# EAGLE schematic mod_switch_battery_voltage (EAGLE 8.4.1)
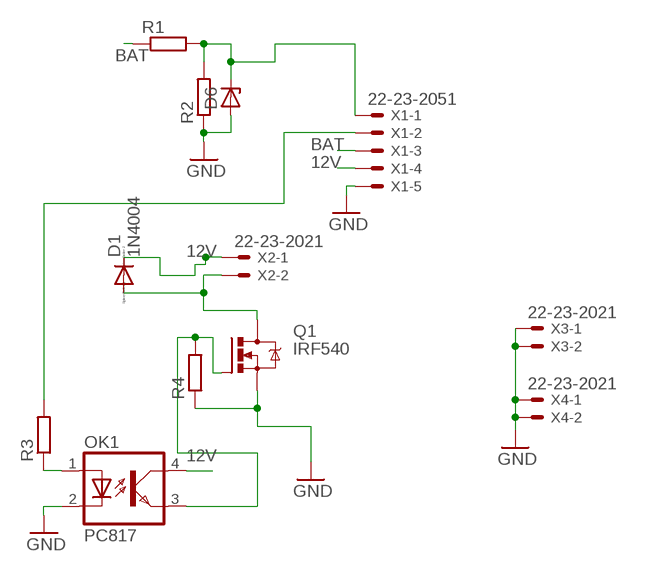
[diagram p0: schematic, sheet 1]

## Parts
D1  1N4004  [DO41-10]
D6  ZENER-DIODEDO34-7  [DO34Z7]
OK1  PC817  [DIL04]
Q1  IRF540  [TO220BV]
R1  R-EU_0204/5  [0204/5]
R2  R-EU_0204/5  [0204/5]
R3  R-EU_0204/5  [0204/5]
R4  R-EU_0204/5  [0204/5]
X1  22-23-2051  [22-23-2051]
X2  22-23-2021  [22-23-2021]
X3  22-23-2021  [22-23-2021]
X4  22-23-2021  [22-23-2021]

## Nets
12V: D1.C OK1.4(COL) X1.4 X2.1
BAT: R1.1 X1.3
GND: D6.A OK1.2(C) Q1.S R2.1 R4.1 X1.5 X3.1 X3.2 X4.1 X4.2
N$4: OK1.1(A) R3.1
N$5: D1.A Q1.D X2.2
N$6: R3.2 X1.2
N$7: OK1.3(EMIT) Q1.G R4.2
N$43: D6.C R1.2 R2.2 X1.1

## Library data of the parts
D1 = diode:1N4004: DIODE general purpose rectifier, 1 A
D6 = diode:ZENER-DIODE: Z-Diode
OK1 = optocoupler:PC817: SHARP OPTO COUPLER; MPN: PC817X4J000F; OC_FARNELL: 9707727; OC_NEWARK: 97K7059
Q1 = transistor-power:IRF540: HEXFET Power MOSFET
R1-R4 = resistor:R-EU_: RESISTOR, European symbol
X1 = con-molex:22-23-2051: .100" (2.54mm) Center Header - 5 Pin; MF: MOLEX; MPN: 22-23-2051; OC_FARNELL: 1462952; OC_NEWARK: 38C9178
X2-X4 = con-molex:22-23-2021: .100" (2.54mm) Center Header - 2 Pin; MF: MOLEX; MPN: 22-23-2021; OC_FARNELL: 1462926; OC_NEWARK: 25C3832